# Altium project tcc_semsf.PrjPcb (part 3 of 3)

## Sheet seccionamento.SchDoc: Seccionamento
size A4; Author: Matheus Gois Vieira; Organization: UnB; Address1: Faculdade do Gama
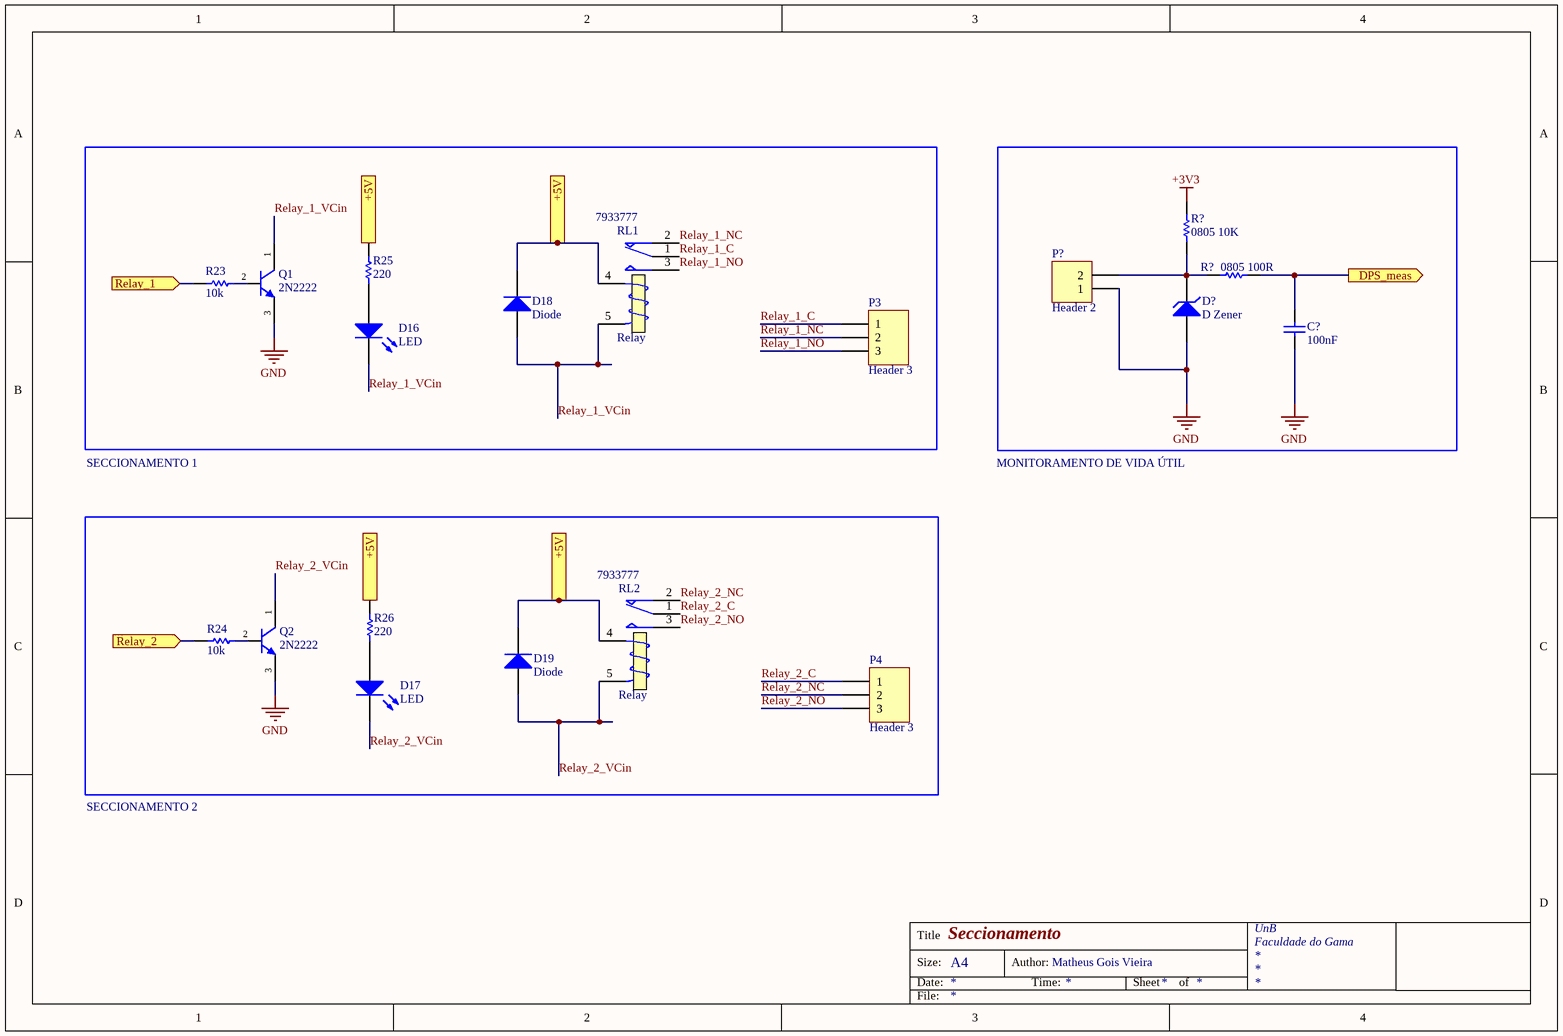
[diagram p2: seccionamento.SchDoc]

### Parts
(Parts that share a designator on the sheet are numbered #1, #2 ... from top to bottom, then left to right.)
C?#4  100nF  [0603]
D16  LED  [LED-0603-G]
D17  LED  [LED-0603-G]
D18  Diode  [SMC]
D19  Diode  [SMC]
D?#4  D Zener  [DIODE-SIGNAL]
P3  Header 3  [HDR1X3]
P4  Header 3  [HDR1X3]
P?  Header 2  [HDR1X2]
Q1  2N2222  [TO-220]
Q2  2N2222  [TO-220]
R23  10k  [R1608[0603]]
R24  10k  [R1608[0603]]
R25  220  [R1608[0603]]
R26  220  [R1608[0603]]
R?#3  0805 10K  [RES0805]
R?#4  0805 100R  [RES0805]
RL1  Relay  Supplier Part Number 1: 7933777  [FINDER-36.11]
RL2  Relay  Supplier Part Number 1: 7933777  [FINDER-36.11]

### Ports
+5V (in), DPS_meas (out), Relay_1 (in), Relay_2 (in)

### Nets
+3V3: R?#3.2
GND: C?#4.2 D?#4.1(A) P?.1 Q1.3(E) Q2.3(E)  [project net VSSA]
Relay_1_C: P3.1 RL1.1(COM)
Relay_1_NC: P3.2 RL1.2(NC)
Relay_1_NO: P3.3 RL1.3(NO)
Relay_1_VCin: D16.2(K) D18.1(A) Q1.1(C) RL1.5(T2)
Relay_2_C: P4.1 RL2.1(COM)
Relay_2_NC: P4.2 RL2.2(NC)
Relay_2_NO: P4.3 RL2.3(NO)
Relay_2_VCin: D17.2(K) D19.1(A) Q2.1(C) RL2.5(T2)
NetC?#4_1: C?#4.1 R?#4.2 ; port DPS_meas
NetD16_1: D16.1(A) R25.1
NetD17_1: D17.1(A) R26.1
NetD18_2: D18.2(K) D19.2(K) R25.2 R26.2 RL1.4(T1) RL2.4(T1) ; port +5V
NetD?#4_2: D?#4.2(K) P?.2 R?#3.1 R?#4.1
NetQ1_2: Q1.2(B) R23.2
NetQ2_2: Q2.2(B) R24.2
NetR23_1: R23.1 ; port Relay_1
NetR24_1: R24.1 ; port Relay_2

### Notes on the sheet
- SECCIONAMENTO 1
- MONITORAMENTO DE VIDA ÚTIL
- SECCIONAMENTO 2
- Title
- Size:
- Date:
- A4
- Author:
- Time:
- Sheet
- of
- File:

### Library data of the parts
C?#4 = CAP CER SMD-0603 100nF - 50V: Capacitor Ceramic 100nF 20% 50V 0603 (1608 Metric) X7R; MPN: C0603C104M5RACTU; Manufacturer: KEMET; CDI: 018177; Op_Temperature: -55 C to +125 C; Type: Capacitor Ceramic; Value: 100nF; Tolerance: 20%; Package: Tape & Reel; RoHS: SIM; Voltage: 50V; Case: 0603 (1608 Metric); Temp_Coefficient: X7R; NCM: *; CDI_Alternate: *; MPN_Alternate: *; Manufacturer_Alternate: *; Price (und.): 0,10000; Price (10k): 0.00741; Supplier 1: RSComponents; Supplier Part Number 1: 6698842
D16 D17 = LED: 0603(H=0.9mm) 绿色 λD=569nm VR=5V VF=2.1V~2.6V IF=20mA PD=100mW; Manufacturer Part Number: LTST-C190GKT; Color: Green; Lens Color: Colorless; Luminous Intensity: 6mcd; Forward Voltage: 2.1V; Viewing Angle: 130°; Lens Style: Clear,Diffused,Colorless,Rectangular; Forward Current: 30mA; Dominant Wavelength: 569nm; Test Current: 10mA; Wavelength: 565nm; Number of LEDs: 1; Power Dissipation: 100mW; Reverse Voltage: 5V; Lens Transparency: Clear; Voltage: 2V; Manufacturer: *; PartNumber: *; Package Type: *; Supplier 1: RSComponents; Supplier Part Number 1: 6920975P; RoHS: Yes; Category: LEDs; Stock 1: 30970; Pricing 1: 250=0,05500, 500=0,05200, 1250=0,03300, 2500=0,03100 (GBP); Mount: Surface Mount; Case/Package: 0603; Number of Pins: 2; Case Code (Metric): 1608; Case Code (Imperial): 0603; Min Operating Temperature: -55°C; Max Operating Temperature: 85°C; Packaging: Tape and Reel; Package Quantity: 1; Illumination Color: Green; Number of Elements: 1; Power Rating: 100mW; Length: 1.6mm; Width: 0.8mm; Height: 0.8mm; Depth: 0.8mm; Radiation Hardening: No; RoHS Compliant: Yes; Lead Free: Lead Free; ComponentLink1URL: https://datasheet.ciiva.com/2109/ltst-c190gkt-2109985.pdf?src-supplier=Digi-Key; ComponentLink1Description: https://datasheet.ciiva.com/2109/ltst-c190gkt-2109985.pdf?src-supplier=Digi-Key; ComponentLink2URL: https://datasheet.ciiva.com/11775/0900766b80dc02a6-11775616.pdf?src-supplier=RSComponents; ComponentLink2Description: https://datasheet.ciiva.com/11775/0900766b80dc02a6-11775616.pdf?src-supplier=RSComponents; ComponentLink3URL: https://datasheet.ciiva.com/12403/lite-on-ltst-c190gkt-187204-12403884.pdf?src-supplier=Mouser; ComponentLink3Description: https://datasheet.ciiva.com/12403/lite-on-ltst-c190gkt-187204-12403884.pdf?src-supplier=Mouser; ComponentLink4URL: https://datasheet.ciiva.com/16392/lite-on20ltst-c190gkt-16392818.pdf?src-supplier=Future+Electronics; ComponentLink4Description: https://datasheet.ciiva.com/16392/lite-on20ltst-c190gkt-16392818.pdf?src-supplier=Future+Electronics; ComponentLink5URL: https://datasheet.ciiva.com/2109/ltst-c190gkt-2109986.pdf?src-supplier=Digi-Key; ComponentLink5Description: https://datasheet.ciiva.com/2109/ltst-c190gkt-2109986.pdf?src-supplier=Digi-Key; ComponentLink6URL: https://datasheet.ciiva.com/2109/ltst-c190gkt-2109987.pdf?src-supplier=Digi-Key; ComponentLink6Description: https://datasheet.ciiva.com/2109/ltst-c190gkt-2109987.pdf?src-supplier=Digi-Key
D18 D19 = Diode: VR=100V IF=200mA; Manufacturer: ON Semiconductor / Fairchild; Manufacturer Part Number: FDLL4148; Polarity: Standard; Max Reverse Current: 5uA; Max Repetitive Reverse Voltage (Vrrm): 100V; Element Configuration: Single; Current Rating: 200mA; Forward Voltage: 1V; Max Forward Surge Current (Ifsm): 4A; Capacitance: 4pF; Power Dissipation: 500mW; Recovery Time: 4ns; Published: 8-Jun-2000; LatestRevisionDate: 17-Jul-2002; LatestRevisionNote: Re-released for DXP Platform.; PackageVersion: Sep-1996; PackageReference: SMC; Publisher: Altium Limited; PackageDescription: DO-214-AB/SMC; 2 C-Bend Leads; Body 7.9 x 5.9 mm, inc. leads (LxW); Code_JEDEC: DO-214-AB; Supplier 1: RSComponents; Supplier Part Number 1: 6708823; RoHS: Yes; Category: Rectifier Diodes; Stock 1: 2100; Pricing 1: 25=0,09200, 500=0,08700, 625=0,08300, 1250=0,07800, 2500=0,07500 (GBP); Mount: Surface Mount; Number of Pins: 34; Weight: 0.05184g; Contact Plating: Tin,Matte; Min Operating Temperature: -65°C; Max Operating Temperature: 175°C; Packaging: Tape and Reel; Package Quantity: 1; Voltage Rating (DC): 100V; Peak Non-Repetitive Surge Current: 4A; Output Current: 200mA; Max Surge Current: 4A; Average Rectified Current: 200mA; Max Reverse Voltage (DC): 100V; Forward Current: 200mA; Reverse Voltage: 100V; Reverse Recovery Time: 4ns; Length: 3.6mm; Width: 1.5mm; Height: 1.5mm; Radiation Hardening: No; RoHS Compliant: Yes; Lead Free: Lead Free; REACH SVHC: No SVHC; ComponentLink1URL: https://datasheet.ciiva.com/34301/785354-34301524.pdf?src-supplier=Jameco; ComponentLink1Description: https://datasheet.ciiva.com/34301/785354-34301524.pdf?src-supplier=Jameco; ComponentLink2URL: https://datasheet.ciiva.com/8053/30071-8053638.pdf?src-supplier=Element14; ComponentLink2Description: https://datasheet.ciiva.com/8053/30071-8053638.pdf?src-supplier=Element14; ComponentLink3URL: https://datasheet.ciiva.com/22714/1716967-22714318.pdf?src-supplier=Element14; ComponentLink3Description: https://datasheet.ciiva.com/22714/1716967-22714318.pdf?src-supplier=Element14; ComponentLink4URL: https://datasheet.ciiva.com/1181/1716967-1181018.pdf?src-supplier=Element14; ComponentLink4Description: https://datasheet.ciiva.com/1181/1716967-1181018.pdf?src-supplier=Element14; ComponentLink5URL: https://datasheet.ciiva.com/1180/1716967-1180972.pdf?src-supplier=Element14; ComponentLink5Description: https://datasheet.ciiva.com/1180/1716967-1180972.pdf?src-supplier=Element14; ComponentLink6URL: https://datasheet.ciiva.com/910/fdll4148-910350.pdf?src-supplier=Digi-Key; ComponentLink6Description: https://datasheet.ciiva.com/910/fdll4148-910350.pdf?src-supplier=Digi-Key; ComponentLink7URL: https://datasheet.ciiva.com/910/fdll4148-910351.pdf?src-supplier=Digi-Key; ComponentLink7Description: https://datasheet.ciiva.com/910/fdll4148-910351.pdf?src-supplier=Digi-Key; ComponentLink8URL: https://datasheet.ciiva.com/910/fdll4148-910349.pdf?src-supplier=Digi-Key; ComponentLink8Description: https://datasheet.ciiva.com/910/fdll4148-910349.pdf?src-supplier=Digi-Key
D?#4 = D Zener: Diode Zener Single 9.1V 5% 500mW 2-Pin(1+Tab) Power Mite T/R; Manufacturer Part Number: 1PMT5924BT1G; Test Current: 41.2mA; Max Power Dissipation: 3.2W; Impedance: 4R; Max Reverse Leakage Current: 5uA; Voltage Rating (DC): 6.2V; ESD Protection: Yes; Manufacturer: *; PartNumber: *; Package Type: *; Supplier 1: Newark; Supplier Part Number 1: 70K6994; RoHS: Yes; Category: Zener Diodes; Pricing 1: 1=0,25500, 3000=0,25500, 9000=0,23200, 24000=0,21400, 45000=0,20000 (USD); Case/Package: DO-216AA; Number of Pins: 2; Contact Plating: Tin,Matte; Min Operating Temperature: -55°C; Max Operating Temperature: 150°C; Packaging: Tape and Reel; Zener Voltage: 9.1V; Voltage Tolerance: 5%; Power Dissipation: 500mW; Element Configuration: Single; Package Quantity: 1; Tolerance: 5%; Power Rating: 3.2W; Breakdown Voltage: 6.2V; Length: 2.18mm; Width: 2.05mm; Height: 1.15mm; Radiation Hardening: No; Lead Free: Lead Free; RoHS Compliant: Yes; Halogen Free: Halogen Free; ComponentLink1URL: https://datasheet.ciiva.com/4735/1pmt5920b-d-40129-4735077.pdf?src-supplier=Mouser; ComponentLink1Description: https://datasheet.ciiva.com/4735/1pmt5920b-d-40129-4735077.pdf?src-supplier=Mouser; ComponentLink2URL: https://datasheet.ciiva.com/26092/1pmt5920b-d-26092383.pdf?src-supplier=Avnet+Europe; ComponentLink2Description: https://datasheet.ciiva.com/26092/1pmt5920b-d-26092383.pdf?src-supplier=Avnet+Europe; ComponentLink3URL: https://datasheet.ciiva.com/10638/1pmt5920b-d-10638985.pdf?src-supplier=Avnet; ComponentLink3Description: https://datasheet.ciiva.com/10638/1pmt5920b-d-10638985.pdf?src-supplier=Avnet
P3 P4 = Header 3: Conn Terminal Block 3 POS 5mm Solder ST Thru-Hole 15A Bulk; Manufacturer: Lumberg; Manufacturer Part Number: KRESS03; Max Supply Voltage (AC): 250V; Number of Poles: 3; Approvals: UL,CSA,VDE; LatestRevisionDate: 17-Jul-2002; LatestRevisionNote: Re-released for DXP Platform.; Publisher: Altium Limited; Supplier 1: RSComponents; Supplier Part Number 1: 2508732301; RoHS: Yes; Category: Connectors; Housing Material: Polyamide; Min Operating Temperature: -25°C; Max Operating Temperature: 100°C; Packaging: Bulk; Number of Rows: 1; Max Current Rating: 15A; Termination: Solder; Orientation: Straight; Current Rating: 15A; Voltage Rating: 250V; Length: 15mm; Depth: 8.3mm; RoHS Compliant: Yes; ComponentLink1URL: https://www.alliedelec.com/m/d/febd0e8d7554432b76be7d34941e766f.pdf?src-supplier=Allied+Electronics; ComponentLink1Description: https://www.alliedelec.com/m/d/febd0e8d7554432b76be7d34941e766f.pdf?src-supplier=Allied+Electronics; ComponentLink2URL: http://components.arrow.com/part/dataview/0323_01039480?src-supplier=Arrow+Europe; ComponentLink2Description: http://components.arrow.com/part/dataview/0323_01039480?src-supplier=Arrow+Europe
P? = Header 2: 间距5.08mm 2pin 母座 12A 320V 弯插 封边; Manufacturer: Phoenix Contact; Manufacturer Part Number: 1757242; Number of Positions: 2; Voltage Rating: 250V; Connector Type: Plug; Gender: Male; Number of Levels: 1; Current: 15A; Voltage: 300V; Pitch: 5.08mm; Approvals: UL,CSA,VDE,EN; LatestRevisionDate: 17-Jul-2002; LatestRevisionNote: Re-released for DXP Platform.; Publisher: Altium Limited; Supplier 1: RSComponents; Supplier Part Number 1: 1896105; RoHS: Yes; Category: Terminal Blocks; Stock 1: 1395; Pricing 1: 5=0,48800, 75=0,44200, 250=0,40400, 500=0,36600, 1000=0,34200 (GBP); Mount: Through Hole; Contact Plating: Tin; Color: Grey,Green; Housing Material: PBT; Contact Material: Tin; Housing Color: Green; Weight: 5.396916oz; Number of Rows: 1; Package Quantity: 50; Packaging: Bulk; Termination: Solder; Number of Contacts: 2; Orientation: Right Angle; Series: MSTBA; Current Rating: 12A; Voltage Rating (DC): 320V; Max Current Rating: 12A; Number of Poles: 2; Number of Positions Per Level: 2; Length: 12.16mm; Width: 12.1mm; Height: 12.08mm; Depth: 12mm; Flammability Rating: UL94 V-0; RoHS Compliant: Yes; REACH SVHC: No SVHC; Lead Free: Lead Free; ComponentLink1URL: https://datasheet.ciiva.com/16096/1757242-16096402.pdf?src-supplier=Onlinecomponents.com; ComponentLink1Description: https://datasheet.ciiva.com/16096/1757242-16096402.pdf?src-supplier=Onlinecomponents.com; ComponentLink2URL: https://datasheet.ciiva.com/15197/getdatasheetpartid-176350-15197328.pdf?src-supplier=Verical; ComponentLink2Description: https://datasheet.ciiva.com/15197/getdatasheetpartid-176350-15197328.pdf?src-supplier=Verical; ComponentLink3URL: https://datasheet.ciiva.com/795/1757242-795407.pdf?src-supplier=Digi-Key; ComponentLink3Description: https://datasheet.ciiva.com/795/1757242-795407.pdf?src-supplier=Digi-Key; ComponentLink4URL: https://datasheet.ciiva.com/29210/569017-da-01-en-grundgehaeuse-1757242-250-st-29210285.pdf?src-supplier=Conrad; ComponentLink4Description: https://datasheet.ciiva.com/29210/569017-da-01-en-grundgehaeuse-1757242-250-st-29210285.pdf?src-supplier=Conrad; ComponentLink5URL: https://datasheet.ciiva.com/7630/100955-7630839.pdf?src-supplier=Element14; ComponentLink5Description: https://datasheet.ciiva.com/7630/100955-7630839.pdf?src-supplier=Element14; ComponentLink6URL: https://datasheet.ciiva.com/33105/1757242-33105868.pdf?src-supplier=Today+Components; ComponentLink6Description: https://datasheet.ciiva.com/33105/1757242-33105868.pdf?src-supplier=Today+Components
Q1 Q2 = NPN: NPN Bipolar Transistor; Manufacturer: *; PartNumber: *; Package Type: *
R23 R24 = R: Res, 10K, 0.01%, 0.25W, 1206, Metal Foil; Manufacturer Part Number: Y163010K0000T9R; Value: 0; Resistance: 10kR; Max Power Dissipation: 250mW; Temperature Coefficient: 0.2ppm/°C; Manufacturer: *; PartNumber: *; Package Type: *; Supplier 1: Digi-Key; Supplier Part Number 1: Y1630-10.0KBCT-ND; RoHS: Yes; Category: Chip SMD Resistors; Stock 1: 1437; Pricing 1: 1=11,40000, 10=10,36300, 25=9,32640, 50=8,03100, 100=7,38340 (USD); Case/Package: 1206; Case Code (Metric): 3216; Case Code (Imperial): 1206; Min Operating Temperature: -55°C; Max Operating Temperature: 150°C; Package Quantity: 1; Packaging: Tape and Reel; Tolerance: 0.01%; Resistor Type: Metal Foil; Number of Terminations: 2; Features: Moisture Resistant,Anti-Sulfur; Length: 0.126inch; Width: 0.062inch; Height: 0.025inch; RoHS Compliant: Yes; ComponentLink1URL: https://datasheet.ciiva.com/29711/vfcpseri-29711161.pdf?src-supplier=Digi-Key; ComponentLink1Description: https://datasheet.ciiva.com/29711/vfcpseri-29711161.pdf?src-supplier=Digi-Key; ComponentLink2URL: https://datasheet.ciiva.com/29711/vfcpseri-29711162.pdf?src-supplier=Digi-Key; ComponentLink2Description: https://datasheet.ciiva.com/29711/vfcpseri-29711162.pdf?src-supplier=Digi-Key; ComponentLink3URL: https://datasheet.ciiva.com/18610/vfcpseri-18610015.pdf?src-supplier=Digi-Key; ComponentLink3Description: https://datasheet.ciiva.com/18610/vfcpseri-18610015.pdf?src-supplier=Digi-Key
R25 R26 = R: Res Thick Film 0603 220 Ohm 1% 1/10W ±100ppm/°C Molded SMD Paper T/R; Manufacturer Part Number: Y163010K0000T9R; Value: 0; Resistance: 10kR; Tolerance: 0.01%; Max Power Dissipation: 250mW; Temperature Coefficient: 0.2ppm/°C; Power Rating: 100mW; Voltage Rating: 50V; Manufacturer: *; PartNumber: *; Package Type: *; RoHS: Yes; Category: Chip SMD Resistors; Stock 1: 11812; Pricing 1: 10=0,01500, 25=0,01200, 50=0,00900, 100=0,00600 (USD); Case/Package: 1206; Case Code (Metric): 3216; Case Code (Imperial): 1206; Min Operating Temperature: -55°C; Max Operating Temperature: 150°C; Package Quantity: 1; Packaging: Tape and Reel; Resistor Type: Metal Foil; Number of Terminations: 2; Features: Moisture Resistant,Anti-Sulfur; Length: 0.126inch; Width: 0.062inch; Height: 0.025inch; RoHS Compliant: Yes; ComponentLink1URL: https://datasheet.ciiva.com/29711/vfcpseri-29711161.pdf?src-supplier=Digi-Key; ComponentLink1Description: https://datasheet.ciiva.com/29711/vfcpseri-29711161.pdf?src-supplier=Digi-Key; ComponentLink2URL: https://datasheet.ciiva.com/29711/vfcpseri-29711162.pdf?src-supplier=Digi-Key; ComponentLink2Description: https://datasheet.ciiva.com/29711/vfcpseri-29711162.pdf?src-supplier=Digi-Key; ComponentLink3URL: https://datasheet.ciiva.com/18610/vfcpseri-18610015.pdf?src-supplier=Digi-Key; ComponentLink3Description: https://datasheet.ciiva.com/18610/vfcpseri-18610015.pdf?src-supplier=Digi-Key; Supplier 1: Newark; Supplier Part Number 1: 82AH6497; Termination: SMD/SMT; Series: AC; ComponentLink4URL: http://www.yageo.com/NewPortal/yageodocoutput?fileName=/pdf/R-Chip/PYu-AC_51_RoHS_L_6.pdf&src-supplier=Mouser; ComponentLink4Description: http://www.yageo.com/NewPortal/yageodocoutput?fileName=/pdf/R-Chip/PYu-AC_51_RoHS_L_6.pdf&src-supplier=Mouser; ComponentLink5URL: http://www.yageo.com/NewPortal/yageodocoutput?fileName=/pdf/R-Chip/PYu-AC_51_RoHS_L_6.pdf&src-supplier=Arrow+Electronics; ComponentLink5Description: http://www.yageo.com/NewPortal/yageodocoutput?fileName=/pdf/R-Chip/PYu-AC_51_RoHS_L_6.pdf&src-supplier=Arrow+Electronics; ComponentLink6URL: http://www.yageo.com/NewPortal/yageodocoutput?fileName=/pdf/R-Chip/PYu-AC_51_RoHS_L_6.pdf&src-supplier=Avnet+Europe; ComponentLink6Description: http://www.yageo.com/NewPortal/yageodocoutput?fileName=/pdf/R-Chip/PYu-AC_51_RoHS_L_6.pdf&src-supplier=Avnet+Europe; ComponentLink7URL: http://www.yageo.com/NewPortal/yageodocoutput?fileName=/pdf/R-Chip/PYu-AC_51_RoHS_L_6.pdf&src-supplier=Digi-Key; ComponentLink7Description: http://www.yageo.com/NewPortal/yageodocoutput?fileName=/pdf/R-Chip/PYu-AC_51_RoHS_L_6.pdf&src-supplier=Digi-Key; ComponentLink8URL: http://www.yageo.com/NewPortal/yageodocoutput?fileName=/pdf/R-Chip/PYu-AC_51_RoHS_L_6.pdf&src-supplier=TTI; ComponentLink8Description: http://www.yageo.com/NewPortal/yageodocoutput?fileName=/pdf/R-Chip/PYu-AC_51_RoHS_L_6.pdf&src-supplier=TTI; ComponentLink9URL: http://www.yageo.com/NewPortal/yageodocoutput?fileName=/pdf/R-Chip/PYu-AC_51_RoHS_L_6.pdf&src-supplier=Schukat; ComponentLink9Description: http://www.yageo.com/NewPortal/yageodocoutput?fileName=/pdf/R-Chip/PYu-AC_51_RoHS_L_6.pdf&src-supplier=Schukat; ComponentLink10URL: http://www.yageo.com/NewPortal/yageodocoutput?fileName=/pdf/R-Chip/PYu-AC_51_RoHS_L_6.pdf&src-supplier=NAC+Semi; ComponentLink10Description: http://www.yageo.com/NewPortal/yageodocoutput?fileName=/pdf/R-Chip/PYu-AC_51_RoHS_L_6.pdf&src-supplier=NAC+Semi; ComponentLink11URL: http://www.yageo.com/NewPortal/yageodocoutput?fileName=/pdf/R-Chip/PYu-AC_51_RoHS_L_6.pdf&src-supplier=Rutronik; ComponentLink11Description: http://www.yageo.com/NewPortal/yageodocoutput?fileName=/pdf/R-Chip/PYu-AC_51_RoHS_L_6.pdf&src-supplier=Rutronik
R?#3 = RC0805FR-0710KL: 10K Omhs 0805 ± 1.00% 0.125W ± 100ppm/℃; Manufacturer: Yageo; Manufacturer Part Number: RC0603FR-0710KL; Tolerance: 1%; Resistance: 10kR; Temperature Coefficient: 100ppm/°C; Voltage Rating: 75V; Voltage Rating (DC): 50V; Power Rating: 100mW; RoHS: Yes; Category: Chip SMD Resistors; Stock 1: 19091268; Pricing 1: 5000=0,00312 (USD); Case/Package: 0603; Number of Pins: 2; Case Code (Imperial): 0603; Case Code (Metric): 1608; Weight: 7.1E-05oz; Size Code: 0603; Min Operating Temperature: -55°C; Max Operating Temperature: 155°C; Resistor Type: Thick Film; Packaging: Tape and Reel; Termination: SMD/SMT; Features: Moisture Resistant; Series: RC; Max Power Dissipation: 100mW; Number of Terminations: 2; Resistance Tolerance: 1%; Construction: Rectangular; Length: 1.6mm; Width: 0.8mm; Height: 0.45mm; Depth: 0.8mm; Lead Pitch: 0.3mm; RoHS Compliant: Yes; REACH SVHC: Unknown; Military Standard: Not; Lead Free: Lead Free; ComponentLink1URL: https://datasheet.ciiva.com/7660/38590-7660789.pdf?src-supplier=Element14; ComponentLink1Description: https://datasheet.ciiva.com/7660/38590-7660789.pdf?src-supplier=Element14; ComponentLink2URL: https://datasheet.ciiva.com/7983/443971-7983596.pdf?src-supplier=Element14; ComponentLink2Description: https://datasheet.ciiva.com/7983/443971-7983596.pdf?src-supplier=Element14; ComponentLink3URL: https://datasheet.ciiva.com/22747/443971-22747519.pdf?src-supplier=Element14; ComponentLink3Description: https://datasheet.ciiva.com/22747/443971-22747519.pdf?src-supplier=Element14; ComponentLink4URL: https://datasheet.ciiva.com/46440/1868787-46440891.pdf?src-supplier=Element14; ComponentLink4Description: https://datasheet.ciiva.com/46440/1868787-46440891.pdf?src-supplier=Element14; ComponentLink5URL: https://datasheet.ciiva.com/7746/1738695-7746239.pdf?src-supplier=Element14; ComponentLink5Description: https://datasheet.ciiva.com/7746/1738695-7746239.pdf?src-supplier=Element14; ComponentLink6URL: https://datasheet.ciiva.com/15189/getdatasheetpartid-409289-15189591.pdf?src-supplier=Verical; ComponentLink6Description: https://datasheet.ciiva.com/15189/getdatasheetpartid-409289-15189591.pdf?src-supplier=Verical; Stock 2: 435000; Pricing 2: 5000=0,00700 (USD); Package Quantity: 1; Technology: THICK FILM; ComponentLink7URL: https://datasheet.ciiva.com/11808/0900766b8106beab-11808151.pdf?src-supplier=RSComponents; ComponentLink7Description: https://datasheet.ciiva.com/11808/0900766b8106beab-11808151.pdf?src-supplier=RSComponents; ComponentLink8URL: https://datasheet.ciiva.com/46447/444164-46447563.pdf?src-supplier=Element14; ComponentLink8Description: https://datasheet.ciiva.com/46447/444164-46447563.pdf?src-supplier=Element14; ComponentLink9URL: https://datasheet.ciiva.com/2456/pyu-r-int-thick-7-2456973.pdf?src-supplier=Digi-Key; ComponentLink9Description: https://datasheet.ciiva.com/2456/pyu-r-int-thick-7-2456973.pdf?src-supplier=Digi-Key; ComponentLink10URL: https://datasheet.ciiva.com/2456/pyu-r-int-thick-7-2456974.pdf?src-supplier=Digi-Key; ComponentLink10Description: https://datasheet.ciiva.com/2456/pyu-r-int-thick-7-2456974.pdf?src-supplier=Digi-Key; ComponentLink11URL: https://datasheet.ciiva.com/2456/pyu-r-int-thick-7-2456972.pdf?src-supplier=Digi-Key; ComponentLink11Description: https://datasheet.ciiva.com/2456/pyu-r-int-thick-7-2456972.pdf?src-supplier=Digi-Key; ComponentLink12URL: https://datasheet.ciiva.com/12669/rc0805-12669688.pdf?src-supplier=Mouser; ComponentLink12Description: https://datasheet.ciiva.com/12669/rc0805-12669688.pdf?src-supplier=Mouser; ComponentLink13URL: https://datasheet.ciiva.com/16747/rc0805-16747087.pdf?src-supplier=Future+Electronics; ComponentLink13Description: https://datasheet.ciiva.com/16747/rc0805-16747087.pdf?src-supplier=Future+Electronics; Supplier 1: RSComponents; Supplier Part Number 1: 6185163
R?#4 = RC0805FR-07100RL: 100R ± 1.00% 0.125W ± 100ppm/℃ 0805; Manufacturer: Yageo; Tolerance: 1%; Voltage Rating (DC): 150V; Temperature Coefficient: 100ppm/°C; Power Rating: 125mW; Application(s): HIGH RELIABILITY; Supplier 1: RSComponents; Manufacturer Part Number: RC0805FR-07100RL; RoHS: Yes; Category: Chip SMD Resistors; Stock 1: 45000; Pricing 1: 5000=0,00700 (USD); Case/Package: 0805; Number of Pins: 2; Case Code (Imperial): 0805; Case Code (Metric): 2012; Weight: 0.000917oz; Min Operating Temperature: -55°C; Max Operating Temperature: 155°C; Resistance: 100R; Packaging: Cut Tape; Resistor Type: Thick Film; Voltage Rating: 150V; Package Quantity: 5000; Termination: SMD/SMT; Number of Terminations: 2; Max Power Dissipation: 125mW; Features: Moisture Resistant; Type: General Purpose; Series: RC; Technology: THICK FILM; Length: 2mm; Width: 1.25mm; Height: 0.5mm; Depth: 1.25mm; Lead Pitch: 0.4mm; REACH SVHC: Unknown; Lead Free: Lead Free; Military Standard: Not; RoHS Compliant: Yes; ComponentLink1URL: https://datasheet.ciiva.com/11808/0900766b8106beab-11808877.pdf?src-supplier=RSComponents; ComponentLink1Description: https://datasheet.ciiva.com/11808/0900766b8106beab-11808877.pdf?src-supplier=RSComponents; ComponentLink2URL: https://datasheet.ciiva.com/7941/1697719-7941680.pdf?src-supplier=Element14; ComponentLink2Description: https://datasheet.ciiva.com/7941/1697719-7941680.pdf?src-supplier=Element14; ComponentLink3URL: https://datasheet.ciiva.com/7941/1686128-7941679.pdf?src-supplier=Element14; ComponentLink3Description: https://datasheet.ciiva.com/7941/1686128-7941679.pdf?src-supplier=Element14; ComponentLink4URL: https://datasheet.ciiva.com/7660/38627-7660797.pdf?src-supplier=Element14; ComponentLink4Description: https://datasheet.ciiva.com/7660/38627-7660797.pdf?src-supplier=Element14; ComponentLink5URL: https://datasheet.ciiva.com/22747/444164-22747535.pdf?src-supplier=Element14; ComponentLink5Description: https://datasheet.ciiva.com/22747/444164-22747535.pdf?src-supplier=Element14; ComponentLink6URL: https://datasheet.ciiva.com/46447/444164-46447562.pdf?src-supplier=Element14; ComponentLink6Description: https://datasheet.ciiva.com/46447/444164-46447562.pdf?src-supplier=Element14; ComponentLink7URL: https://datasheet.ciiva.com/2456/pyu-r-int-thick-7-2456988.pdf?src-supplier=Digi-Key; ComponentLink7Description: https://datasheet.ciiva.com/2456/pyu-r-int-thick-7-2456988.pdf?src-supplier=Digi-Key; ComponentLink8URL: https://datasheet.ciiva.com/2456/pyu-r-int-thick-7-2456989.pdf?src-supplier=Digi-Key; ComponentLink8Description: https://datasheet.ciiva.com/2456/pyu-r-int-thick-7-2456989.pdf?src-supplier=Digi-Key; ComponentLink9URL: https://datasheet.ciiva.com/2456/pyu-r-int-thick-7-2456987.pdf?src-supplier=Digi-Key; ComponentLink9Description: https://datasheet.ciiva.com/2456/pyu-r-int-thick-7-2456987.pdf?src-supplier=Digi-Key; ComponentLink10URL: https://datasheet.ciiva.com/17082/rc0805-17082697.pdf?src-supplier=Future+Electronics; ComponentLink10Description: https://datasheet.ciiva.com/17082/rc0805-17082697.pdf?src-supplier=Future+Electronics; Supplier Part Number 1: 6185135
RL1 RL2 = Relay: SPDT PCB Mount Non-Latching Relay Through Hole; 12V dc; Manufacturer Part Number: 36.11.9.012.4011; Contact Current Rating: 10A; Coil Resistance: 400R; Coil Power: 360mW; Switching Capacity: 500W; Test Voltage: 2.5kV; Coil Current: 30mA; Ratings: IP67; Manufacturer: *; Package Type: *; PartNumber: *; Supplier 1: RSComponents; RoHS: Yes; Category: Power Relays; Stock 1: 639; Pricing 1: 1=1,68000, 10=1,56000, 25=1,47000, 50=1,43000, 100=1,32000 (GBP); Mount: PCB; Contact Material: Tin,Silver; Min Operating Temperature: -40°C; Max Operating Temperature: 85°C; Termination: Through Hole; Switching Current: 10A; Throw Configuration: SPDT; Coil Voltage (DC): 12V; Length: 19mm; Width: 15.5mm; Height: 16mm; Depth: 15.5mm; REACH SVHC: No SVHC; RoHS Compliant: Yes; ComponentLink1URL: https://datasheet.ciiva.com/30469/0900766b812a2bcc-30469325.pdf?src-supplier=RSComponents; ComponentLink1Description: https://datasheet.ciiva.com/30469/0900766b812a2bcc-30469325.pdf?src-supplier=RSComponents; ComponentLink2URL: https://datasheet.ciiva.com/22666/1699475-22666502.pdf?src-supplier=Element14; ComponentLink2Description: https://datasheet.ciiva.com/22666/1699475-22666502.pdf?src-supplier=Element14

## Sheet controlador.SchDoc
size A4
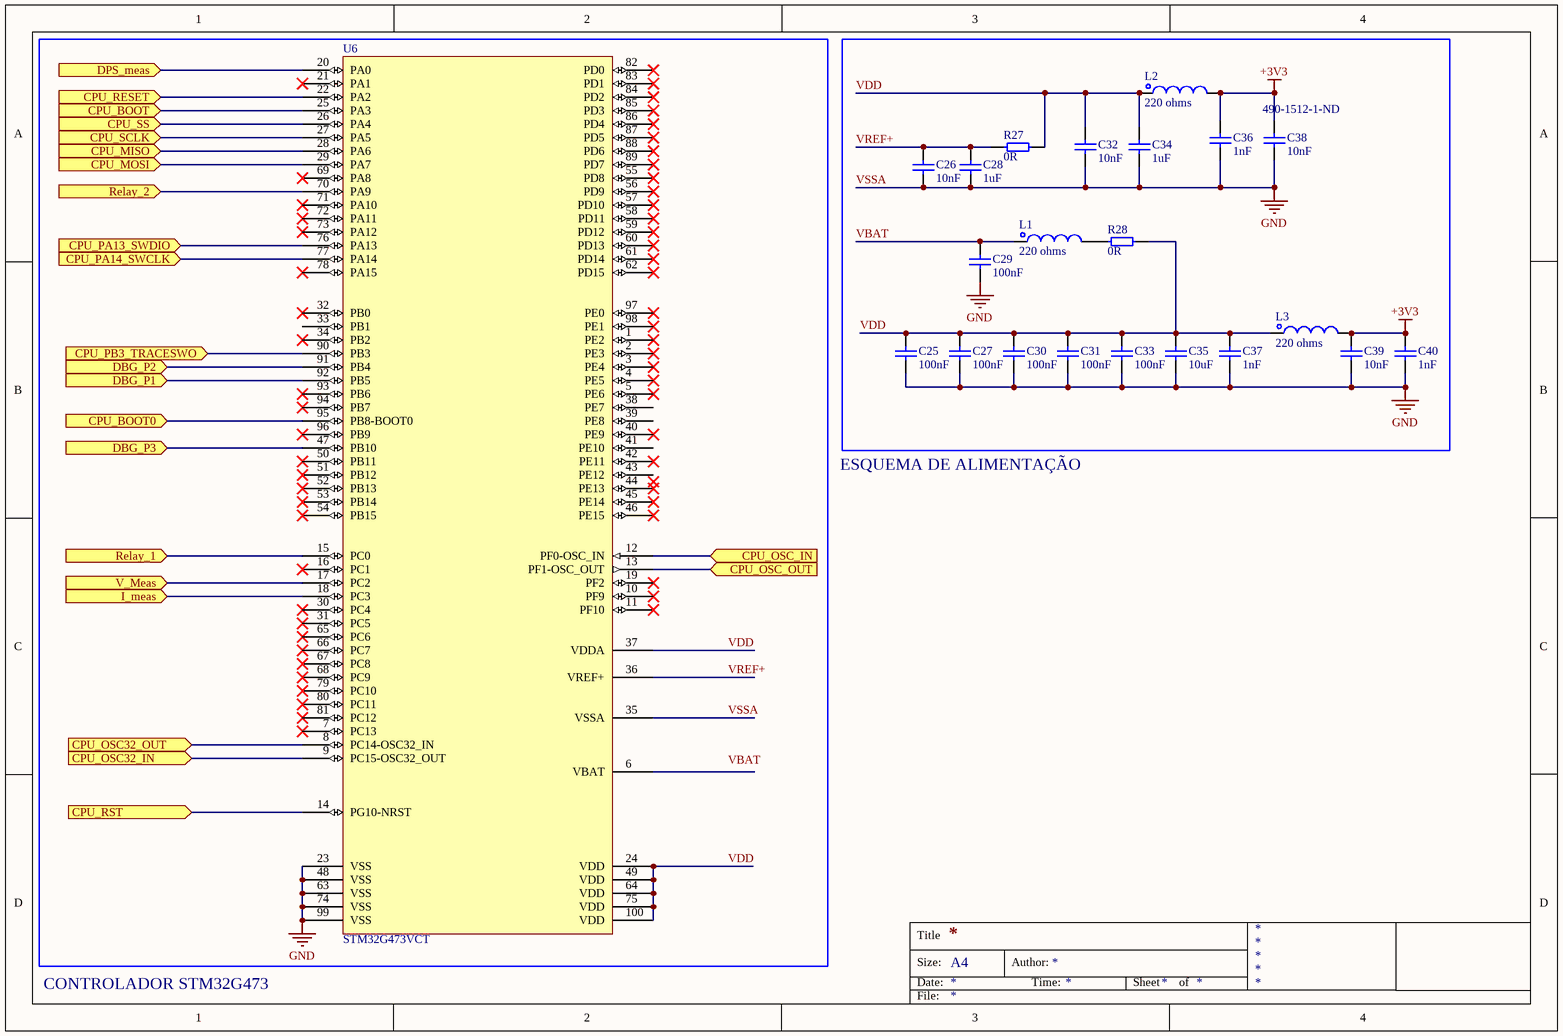
[diagram p3: controlador.SchDoc]

### Parts
C25  100nF  [0603]
C26  10nF  [0603]
C27  100nF  [0603]
C28  1uF  [0603]
C29  100nF  [0603]
C30  100nF  [0603]
C31  100nF  [0603]
C32  10nF  [0603]
C33  100nF  [0603]
C34  1uF  [0603]
C35  10uF  [0603]
C36  1nF  [0603]
C37  1nF  [0603]
C38  10nF  Supplier Part Number 1: 490-1512-1-ND  [0603]
C39  10nF  [0603]
C40  1nF  [0603]
L1  220 ohms  [0603]
L2  220 ohms  [0603]
L3  220 ohms  [0603]
R27  0R  [0603]
R28  0R  [0603]
U6  STM32G473VCT  [LQFP100_14MMX14MM]

### Ports
CPU_BOOT0 (in), CPU_BOOT (in), CPU_MISO (in), CPU_MOSI (in), CPU_OSC32_IN (in), CPU_OSC32_OUT (in), CPU_OSC_IN (in), CPU_OSC_OUT (in), CPU_PA13_SWDIO (in), CPU_PA14_SWCLK (in), CPU_PB3_TRACESWO (in), CPU_RESET (in), CPU_RST (in), CPU_SCLK (in), CPU_SS (in), DBG_P1 (in), DBG_P2 (in), DBG_P3 (in), DPS_meas (in), I_meas (in), Relay_1 (in), Relay_2 (in), V_Meas (in)

### Nets
+3V3: C36.2 C38.2 C39.2 C40.2 L2.2 L3.2
VSSA: C25.2 C26.1 C27.2 C28.1 C29.2 C30.2 C31.2 C32.1 C33.2 C34.1 C35.1 C36.1 C37.1 C38.1 C39.1 C40.1 U6.18(PC3) U6.23(VSS) U6.35(VSSA) U6.48(VSS) U6.63(VSS) U6.74(VSS) U6.99(VSS) ; port I_meas  [also labelled GND]
CPU_RST: U6.14(PG10-NRST) ; port CPU_RST
VBAT: C29.1 L1.1
VDD: C25.1 C27.1 C30.1 C31.1 C32.2 C33.1 C34.2 C35.2 C37.2 L2.1 L3.1 R27.1 R28.2 U6.24(VDD) U6.37(VDDA) U6.49(VDD) U6.64(VDD) U6.75(VDD) U6.100(VDD)
VREF+: C26.2 C28.2 R27.2 U6.36(VREF+)
NetC18_2: U6.17(PC2) ; port V_Meas
NetC46_2: U6.8(PC14-OSC32_IN) ; port CPU_OSC32_OUT
NetC47_2: U6.9(PC15-OSC32_OUT) ; port CPU_OSC32_IN
NetC48_2: U6.13(PF1-OSC_OUT) ; port CPU_OSC_OUT
NetC49_2: U6.12(PF0-OSC_IN) ; port CPU_OSC_IN
NetC?#4_1: U6.20(PA0) ; port DPS_meas
NetD20_2: U6.77(PA14) ; port CPU_PA14_SWCLK
NetD21_2: U6.76(PA13) ; port CPU_PA13_SWDIO
NetD24_2: U6.90(PB3) ; port CPU_PB3_TRACESWO
NetL1_2: L1.2 R28.1
NetQ6_3: U6.95(PB8-BOOT0) ; port CPU_BOOT0
NetR23_1: U6.15(PC0) ; port Relay_1
NetR24_1: U6.70(PA9) ; port Relay_2
NetR40_1: U6.91(PB4) ; port DBG_P2
NetR41_1: U6.47(PB10) ; port DBG_P3
NetR42_1: U6.92(PB5) ; port DBG_P1
NetU6_22: U6.22(PA2) ; port CPU_RESET
NetU6_25: U6.25(PA3) ; port CPU_BOOT
NetU6_26: U6.26(PA4) ; port CPU_SS
NetU6_27: U6.27(PA5) ; port CPU_SCLK
NetU6_28: U6.28(PA6) ; port CPU_MISO
NetU6_29: U6.29(PA7) ; port CPU_MOSI

Not connected (* = marked no-connect by the designer): U6 1(PE2)* 2(PE3)* 3(PE4)* 4(PE5)* 5(PE6)* 6(VBAT) 7(PC13)* 10(PF9)* 11(PF10)* 16(PC1)* 19(PF2)* 21(PA1)* 30(PC4)* 31(PC5)* 32(PB0)* 33(PB1) 34(PB2)* 38(PE7) 39(PE8) 40(PE9)* 41(PE10) 42(PE11)* 43(PE12) 44(PE13)* 45(PE14)* 46(PE15)* 50(PB11)* 51(PB12)* 52(PB13)* 53(PB14)* 54(PB15)* 55(PD8)* 56(PD9)* 57(PD10)* 58(PD11)* 59(PD12)* 60(PD13)* 61(PD14)* 62(PD15)* 65(PC6)* 66(PC7)* 67(PC8)* 68(PC9)* 69(PA8)* 71(PA10)* 72(PA11)* 73(PA12)* 78(PA15)* 79(PC10)* 80(PC11)* 81(PC12)* 82(PD0)* 83(PD1)* 84(PD2)* 85(PD3)* 86(PD4)* 87(PD5)* 88(PD6)* 89(PD7)* 93(PB6)* 94(PB7)* 96(PB9)* 97(PE0)* 98(PE1)*

### Notes on the sheet
- ESQUEMA DE ALIMENTAÇÃO
- CONTROLADOR STM32G473
- Labels drawn without touching a wire or pin: VBAT
- Title
- Size:
- Date:
- A4
- Author:
- Time:
- Sheet
- of
- File:

### Library data of the parts
C25 C27 C29-C31 C33 = CAP CER SMD-0603 100nF - 50V: as C?#4 on sheet seccionamento; Type: Capacitor Ceramic; Value: 100nF; Tolerance: 20%; Package: Tape & Reel; RoHS: SIM; Voltage: 50V; Case: 0603 (1608 Metric); Temp_Coefficient: X7R; NCM: *; CDI_Alternate: *; MPN_Alternate: *; Manufacturer_Alternate: *; Price (und.): 0,10000; Price (10k): 0.00741; Supplier 1: RSComponents; Supplier Part Number 1: 6698842
C26 C32 C38 C39 = CAP CER SMD-0603 10nF - 50V: Capacitor Ceramic 10nF 10% 50V 0603 (1608 Metric) X7R; MPN: 06035C103KAT4A; Manufacturer: AVX; CDI: 017932; Op_Temperature: -55 C to +125 C; Type: Capacitor Ceramic; Value: 10nF; Tolerance: 10%; Package: Tape & Reel; RoHS: SIM; Voltage: 50V; Case: 0603 (1608 Metric); Temp_Coefficient: X7R; NCM: *; CDI_Alternate: *; MPN_Alternate: *; Manufacturer_Alternate: *; Price (und.): 0,10000; Price (10k): 0.00621
  C26 C39: Supplier 1: Digi-Key; Supplier Part Number 1: 490-1512-1-ND
  C38: Supplier 1: Digi-Key
C28 C34 = CAP CER SMD-0603 1uF - 16V: Capacitor Ceramic 1uF 10% 16V 0603 (1608 Metric) X7R; MPN: 0603YC105KAT2A; Manufacturer: AVX; CDI: 018282; Op_Temperature: -55 C to +125 C; Type: Capacitor Ceramic; Value: 1uF; Tolerance: 10%; Package: Tape & Reel; RoHS: SIM; Voltage: 16V; Case: 0603 (1608 Metric); Temp_Coefficient: X7R; NCM: *; CDI_Alternate: *; MPN_Alternate: *; Manufacturer_Alternate: *; Price (und.): 0,21000; Price (10k): 0.03795; Supplier 1: Digi-Key; Supplier Part Number 1: 490-3897-1-ND
  C34: Supplier 2: Digi-Key; Supplier Part Number 2: 490-1512-1-ND
C35 = CAP CER SMD-0603 10uF - 10V: Capacitor Ceramic 10µF 10% 10V 0603 (1608 Metric) X7R; MPN: C3216X7R1C106K160AC; Manufacturer: TDK; MPN_Alternate: C0603C106M8PAC7411; CDI: 017467; Op_Temperature: -55 C to +125 C; Type: Capacitor Ceramic; Value: 10uF; Voltage: 10V; Tolerance: 10%; Package: Tape & Reel; Case: 0603 (1608 Metric); Temp_Coefficient: X7R; RoHS: SIM; NCM: *; CDI_Alternate: *; Manufacturer_Alternate: *; Price (und.): 0.33; Price (10k): 0.07; Supplier 1: Newark; Supplier Part Number 1: 03AC2652
C36 C37 C40 = CAP CER SMD-0603 1nF - 50V: Capacitor Ceramic 1nF 5% 50V 0603 (1608 Metric) C0G (NP0); MPN: GRM1885C1H102JA01D; Manufacturer: Murata; MPN_Alternate: CGA3E2C0G1H102J080AE; CDI: 017469; Op_Temperature: -55 C to +125 C; Type: Capacitor Ceramic; Value: 1nF; Tolerance: 5%; Package: Tape & Reel; RoHS: SIM; Voltage: 50V; Case: 0603 (1608 Metric); Temp_Coefficient: C0G (NP0); NCM: *; CDI_Alternate: *; Manufacturer_Alternate: *; Price (und.): 0,10000; Price (10k): 0.01032; Supplier 1: RSComponents; Supplier Part Number 1: 1356303
L1-L3 = INDUTOR BEAD - 2.2A - 50 OHMS 100 MHZ: INDUTOR BEAD - 2.2A - 220 OHMS 100 MHZ; MPN: BLM18KG221SZ1D; Manufacturer: Murata; Type: Ferrite Bead; Tolerance: 25%; Frequency: 100 MHz; Op_Temperature: -55°C ~ 125°C; CDI: 014249; Value: 220 ohms; Package: Tape & Reel; RoHS: SIM; Case: 0603; Current: 2.2 A; Price (10k): 0.02146; Price (und.): 0,10000; Supplier 1: Newark; Supplier Part Number 1: 73M9123
R27 R28 = RES SMD-0603 0R 1% 1/10W: Resistor Thick Film 0R Jumper 0.1W, 1/10W 0603 (1608 metric) Jumper; MPN: CRCW06030000Z0EA; Manufacturer: Vishay; CDI: 017334; Op_Temperature: -55 C to +155 C; Type: Resistor Thick Film; Value: 0R; Tolerance: Jumper; Package: Tape & Reel; RoHS: SIM; Power (Watts): 1/10W; Case: 0603; Price (10k): 0.00318; Price (und.): 0,10000
U6 = STM32G473VCT: Manufacturer: ST - Microlectronics; Op_Temperature: -40°C ~ 85°C; CDI: 020680; Value: STM32G473VCT; MPN: STM32G473VCT; Case: LQFP-100; Package: Tray; Price (10k): 4.78; Price (und.): 8.87; RoHS: SIM; Type: ARM Microcontrollers - MCU; Supplier 1: Newark; Supplier Part Number 1: 39AH3584

## Sheet perifericos.SchDoc: Periféricos do Controlador
size A4; Author: Matheus Gois Vieira; Address1: UnB; Address2: Faculdade do Gama
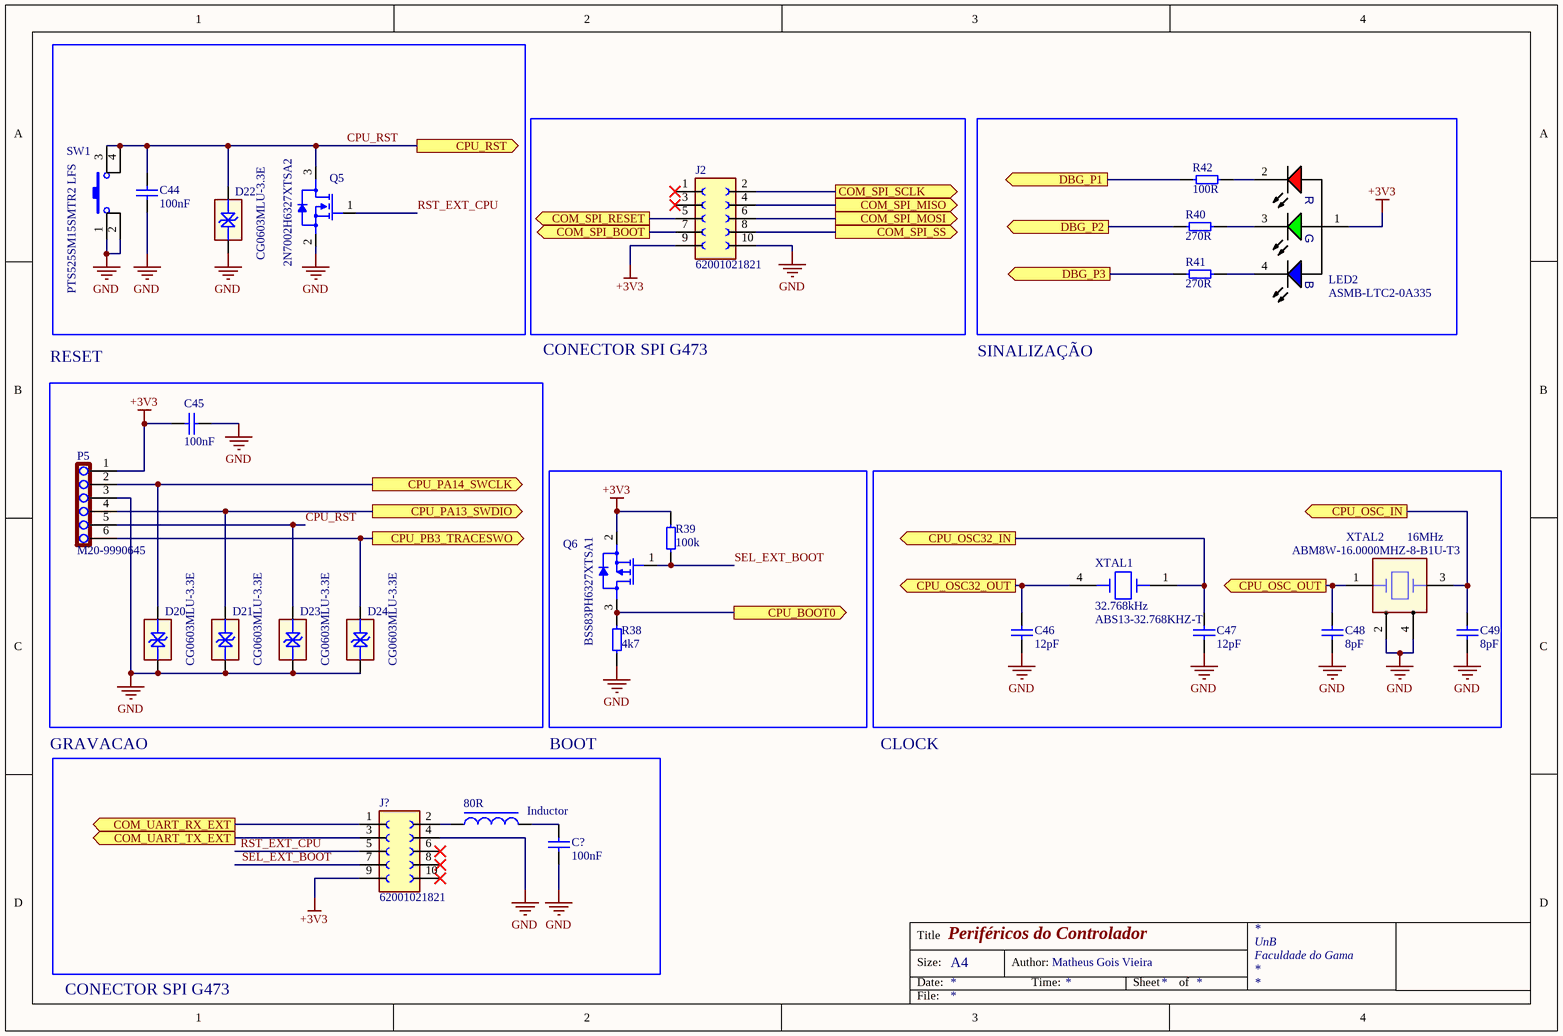
[diagram p4: perifericos.SchDoc]

### Parts
(Parts that share a designator on the sheet are numbered #1, #2 ... from top to bottom, then left to right.)
80R  Inductor  [R1608[0603]]
C44  100nF  [0603]
C45  100nF  [0603]
C46  12pF  [0603]
C47  12pF  [0603]
C48  8pF  [0603]
C49  8pF  [0603]
C?#5  100nF  [0603]
D20  CG0603MLU-3.3E  [DIODE-0603]
D21  CG0603MLU-3.3E  [DIODE-0603]
D22  CG0603MLU-3.3E  [DIODE-0603]
D23  CG0603MLU-3.3E  [DIODE-0603]
D24  CG0603MLU-3.3E  [DIODE-0603]
J2  62001021821  [62001021821]
J?  62001021821  [62001021821]
LED2  ASMB-LTC2-0A335  [ASMB-LTC2-0A335]
P5  M20-9990645  [HDR1X6-2.54MM]
Q5  2N7002H6327XTSA2  [CI-SOT-23]
Q6  BSS83PH6327XTSA1  [CI-SOT-23]
R38  4k7  [0603]
R39  100k  [0603]
R40  270R  [0603]
R41  270R  [0603]
R42  100R  [0603]
SW1  value PTS525SM15SMTR2 LFS  [SWTCH]  (hidden comment: Tact Switch)
XTAL1  32.768kHz  MPN: ABS13-32.768KHZ-T  [XTAL4P_ABS13]
XTAL2  16MHz  MPN: ABM8W-16.0000MHZ-8-B1U-T3  [XTAL4P]

### Blocks framed on the sheet
RESET: C45 D20 D21 D23 D24 P5

### Ports
COM_SPI_BOOT (out), COM_SPI_MISO (out), COM_SPI_MOSI (out), COM_SPI_RESET (out), COM_SPI_SCLK (out), COM_SPI_SS (out), COM_UART_RX_EXT (out), COM_UART_TX_EXT (out), CPU_BOOT0 (out), CPU_OSC32_IN (out), CPU_OSC32_OUT (out), CPU_OSC_IN (out), CPU_OSC_OUT (out), CPU_PA13_SWDIO (out), CPU_PA14_SWCLK (out), CPU_PB3_TRACESWO (out), CPU_RST (out), DBG_P1 (out), DBG_P2 (out), DBG_P3 (out)

### Nets
+3V3: C45.1 J2.9 J?.9 LED2.1(A) P5.1 Q6.2(S) R39.2
GND: C44.2 C45.2 C46.1 C47.1 C48.1 C49.1 C?#5.2 D20.1 D21.1 D22.1 D23.1 D24.1 J2.10 J?.4 P5.3 Q5.2(S) R38.1 SW1.1 SW1.2 XTAL2.2(GND) XTAL2.4(GND)  [project net VSSA]
CPU_RST: C44.1 D22.2 D23.2 P5.5 Q5.3(D) SW1.3 SW1.4 ; port CPU_RST
RST_EXT_CPU: J?.5 Q5.1(G)
SEL_EXT_BOOT: J?.7 Q6.1(G) R39.1
Net80R_1: 80R.1 J?.2
Net80R_2: 80R.2 C?#5.1
NetC46_2: C46.2 XTAL1.4 ; port CPU_OSC32_OUT
NetC47_2: C47.2 XTAL1.1 ; port CPU_OSC32_IN
NetC48_2: C48.2 XTAL2.1 ; port CPU_OSC_OUT
NetC49_2: C49.2 XTAL2.3 ; port CPU_OSC_IN
NetD20_2: D20.2 P5.2 ; port CPU_PA14_SWCLK
NetD21_2: D21.2 P5.4 ; port CPU_PA13_SWDIO
NetD24_2: D24.2 P5.6 ; port CPU_PB3_TRACESWO
NetJ2_2: J2.2 ; port COM_SPI_SCLK
NetJ2_4: J2.4 ; port COM_SPI_MISO
NetJ2_5: J2.5 ; port COM_SPI_RESET
NetJ2_6: J2.6 ; port COM_SPI_MOSI
NetJ2_7: J2.7 ; port COM_SPI_BOOT
NetJ2_8: J2.8 ; port COM_SPI_SS
NetJ?_1: J?.1 ; port COM_UART_RX_EXT
NetJ?_3: J?.3 ; port COM_UART_TX_EXT
NetLED2_2: LED2.2(R) R42.2
NetLED2_3: LED2.3(G) R40.2
NetLED2_4: LED2.4(B) R41.2
NetQ6_3: Q6.3(D) R38.2 ; port CPU_BOOT0
NetR40_1: R40.1 ; port DBG_P2
NetR41_1: R41.1 ; port DBG_P3
NetR42_1: R42.1 ; port DBG_P1

Not connected (* = marked no-connect by the designer): J2 1* 3(2)*; J? 6(8)* 8(7)* 10(6)*

### Notes on the sheet
- CONECTOR SPI G473
- SINALIZAÇÃO
- GRAVACAO
- BOOT
- CLOCK
- Title
- Size:
- Date:
- A4
- Author:
- Time:
- Sheet
- of
- File:

### Library data of the parts
80R = L: Manufacturer: *; PartNumber: *; Package Type: *; Value: *
C44 C45 C?#5 = CAP CER SMD-0603 100nF - 50V: as C?#4 on sheet seccionamento; Type: Capacitor Ceramic; Value: 100nF; Tolerance: 20%; Package: Tape & Reel; RoHS: SIM; Voltage: 50V; Case: 0603 (1608 Metric); Temp_Coefficient: X7R; NCM: *; CDI_Alternate: *; MPN_Alternate: *; Manufacturer_Alternate: *; Price (und.): 0,10000; Price (10k): 0.00741
C46 C47 = CAP CER SMD-0603 12pF - 50V: Capacitor Ceramic 12pF 10% 50V 0603 (1608 Metric) C0G (NP0); MPN: 06035A120KAT2A; Manufacturer: AVX; CDI: 020618; Op_Temperature: -55 C to +125 C; Type: Capacitor Ceramic; Value: 12pF; Voltage: 50V; Tolerance: 10%; Package: Tape & Reel; Case: 0603 (1608 Metric); Temp_Coefficient: C0G (NP0); RoHS: SIM; NCM: *; CDI_Alternate: *; MPN_Alternate: *; Manufacturer_Alternate: *; Price (und.): 0.22; Price (10k): 0.039
C48 C49 = CAP CER SMD-0603 8pF - 50V: Capacitor Ceramic 8pF 50V 0603 (1608 Metric) C0G (NP0); MPN: CC0603DRNPO9BN8R0; Manufacturer: Yageo; CDI: 020657; Tolerance: 0.5pF; Op_Temperature: -55 C to +125 C; Type: Capacitor Ceramic; Value: 8pF; Package: Tape & Reel; RoHS: SIM; Voltage: 50V; Case: 0603 (1608 Metric); Temp_Coefficient: C0G (NP0); NCM: *; CDI_Alternate: *; MPN_Alternate: *; Manufacturer_Alternate: *; Price (und.): 0,10000; Price (10k): 0.01346
D20-D24 = DIODE SMD CG0603MLU-3.3E: TVS DIODE 3.3V 25V 0603 (1608 metric); Manufacturer: Bourns; Type: Diode TVS; Op_Temperature: -40 C to +125 C; CDI: 014983; Value: CG0603MLU-3.3E; Package: Tape & Reel; MPN: CG0603MLU-3.3E; RoHS: SIM; Price (und.): 0,44; Voltage: 3.3V; Case: 0603 (1608 metric); Price (10k): 0.112
J2 J? = 62001021821: Female header Temperature range: -40 ... +125 Â°C Colour: Black Connector Design: Double Row / Straight Connector Termination: THT Contact material: Gold-Plated Copper Gender of contacts: Female Housing Material: Polybutylene Terephthalate (PBT) Pitch: 2 mm Series: WR-PHD Poles: 10 Rated current: 2 A Rated voltage: 250 VAC; MF: WÃ¼rth Elektronik; SnapEDA_Link: https://www.snapeda.com/parts/62001021821/Wurth+Elektronik/view-part/?ref=snap; Availability: In Stock; Package: None; Check_prices: https://www.snapeda.com/parts/62001021821/Wurth+Elektronik/view-part/?ref=eda; Price: None; MP: 62001021821; Purchase-URL: https://pricing.snapeda.com/search/part/62001021821/?ref=eda; Value: *
LED2 = LED2 SMD-2121 PLCC4 RGB AComum: LED SMD-2121 PLCC4 RGB - 70mcd Red (2V), 300mcd Green (2.7V), 50mcd Blue (2.7V); Manufacturer: Broadcom Limited; Type: LED SMD; Millicandela_Rating: 70mcd Red, 300mcd Green, 50mcd Blue; Voltage_Forward_Vf_Typ: Red (2V), Green (2.7V), Blue (2.7V); Wavelength_Dominant: 621nm Red, 525nm Green, 468nm Blue; Current_Test: 5mA; Complement_Value: Angle 105°; PCB_INFO: Assembly; Extra_Info: -40 C to +85 C; Engineering_Change_Status_Code: Pending; Revisao: A; CDI: 020457; Component Type: Standard; Value: ASMB-LTC2-0A335; Color: RGB; Package: PLCC4; Size_Dimension: 2.10mm L x 2.10mm W; MPN: ASMB-LTC2-0A335; Model_File: LED; RoHS: SIM; Case: 4-SMD, J-Lead; Price (10k): 0.16500; Price (und.): 0,58000
P5 = HEADER 1x6 PTH: Header, 6-Pin, 2.54mm, PCB; Manufacturer: HARWIN; Op_Temperature: -40°C ~ 105°C; CDI: 020492; Type: Header; Value: M20-9990645; Package: Bulk; MPN: M20-9990645; RoHS: SIM; Price (10k): 0.11029; Price (und.): 0.29000; Case: PTH 1mm 2X2 2.54MM
Q5 = MOSFET N-CHANNEL 2N7002: MOSFET N-CH 60V 300mA SOT23-3; Manufacturer: Infineon; Op_Temperature: -55°C ~ 150°C; CDI: 020458; Type: MOSFET; Value: 2N7002H6327XTSA2; Current_Id: 300mA; Package: Tape & Reel; MPN: 2N7002H6327XTSA2; RoHS: SIM; Case: SOT-23-3; Current: 300mA; Price (10k): 0.04370; Price (und.): 0,29000
Q6 = MOSFET P-CHANNEL BSS83P: MOSFET P-CH 60V 330mA SOT23-3; Manufacturer: Infineon; Op_Temperature: -55°C ~ 150°C; CDI: 020459; Type: MOSFET; Value: BSS83PH6327XTSA1; Current_Id: 330mA; Package: Tape & Reel; MPN: BSS83PH6327XTSA1; RoHS: SIM; Case: SOT-23-3; Current: 330mA; Price (10k): 0.10362; Price (und.): 0,49000
R38 = RES SMD-0603 4k7 0.5% 1/16W: Resistor Thick Film 4k7 0.5% 0.063W, 1/16W 0603 (1608 metric) +/- 25 PPM / K; MPN: RR0816P-472-D; Manufacturer: Susumu; CDI: 019051; Op_Temperature: -55 C to +125 C; Type: Resistor Thick Film; Value: 4k7; Package: Tape & Reel; RoHS: SIM; Tolerance: 0.5%; Power (Watts): 1/16W; Case: 0603; Price (10k): 0.00993; Price (und.): 0,10000
R39 = RES SMD-0603 100k 1% 1/10W: Resistor Thick Film 100k 1% 0.1W, 1/10W 0603 (1608 metric) +/- 100 PPM / K; MPN: CRCW0603100KFKEA; Manufacturer: Vishay; MPN_Alternate: ERJ-3EKF1003V; CDI: 017438; Op_Temperature: -55 C to +155 C; Type: Resistor Thick Film; Value: 100k; Tolerance: 1%; Package: Tape & Reel; RoHS: SIM; Power (Watts): 1/10W; Case: 0603; Price (10k): 0.00468; Price (und.): 0,10000
R40 R41 = RES SMD-0603 270R 1% 1/10W: Resistor Thick Film 270 Ohms ±1% 0.1W, 1/10W Chip Resistor 0603 (1608 Metric) Automotive AEC-Q200 Thick Film; MPN: RMCF0603FT270R; Manufacturer: Stackpole Electronics Inc; CDI: 013719; Op_Temperature: -55 C to +155 C; Type: Resistor Thick Film; Value: 270R; Tolerance: ±1%; Package: Tape & Reel; RoHS: SIM; Power (Watts): 1/10W; Voltage: *; Case: 0603; NCM: *; CDI_Alternate: *; MPN_Alternate: *; Manufacturer_Alternate: *; Price (und.): 0,10000; Price (10k): 0.00218
R42 = RES SMD-0603 100R 1% 1/10W: Resistor Thick Film 100R 1% 0.1W, 1/10W 0603 (1608 metric) +/- 100 PPM / K; MPN: RC0603FR-07100RL; Manufacturer: Yageo; CDI: 020463; Op_Temperature: -55 C to +155 C; Type: Resistor Thick Film; Value: 100R; Tolerance: 1%; Package: Tape & Reel; RoHS: SIM; Power (Watts): 1/10W; Case: 0603; Price (10k): 0.002; Price (und.): 0.10
SW1 = Tact Switch: Chave pushbuttom NA polo simples SMD; Manufacturer: C&K; CDI: 014225; Op_Temperature: -20°C ~ 70°C; MPN: PTS525SM15SMTR2 LFS; Case: 5.25x5.25mm; Package: Tape & Reel; Price (10k): 0.16066; Price (und.): 0,29000; RoHS: SIM; Type: Switches
XTAL1 = XTAL-ABS13-32.768kHz: Crystal 32.768kHz 20PPM SMD; Manufacturer: Abracon; Clamper_PN: XTAL0010; Op_Temperature: -40°C ~ 85°C; CDI: 020477; Case: 2-SMD; Value: 32.768kHz; Tolerance: 20PPM; Package: Tape & Reel; Price (10k): 0.45; Price (und.): 0.79; RoHS: SIM; Type: Crystals
XTAL2 = XTAL-ABM8W-16MHz: Crystal 16MHz 10PPM SMD; Manufacturer: Abracon; Clamper_PN: XTAL0010; Op_Temperature: -20°C ~ 70°C; CDI: 020479; Case: 4-SMD; Value: 16MHz; Tolerance: 10PPM; Package: Tape & Reel; Price (10k): 0.33408; Price (und.): 0,69000; RoHS: SIM; Type: Crystals

## Nets that join several sheets
+3V3: seccionamento (R?#3.2), controlador (6 pins), perifericos (7 pins)
VSSA: power_supply (7 pins), cond_sinais (21 pins), seccionamento (5 pins), controlador (23 pins), perifericos (21 pins)
CPU_RST: controlador (U6.14), perifericos (7 pins)
NetC18_2: cond_sinais (8 pins), controlador (U6.17)
NetC46_2: controlador (U6.8), perifericos (C46.2 XTAL1.4)
NetC47_2: controlador (U6.9), perifericos (C47.2 XTAL1.1)
NetC48_2: controlador (U6.13), perifericos (C48.2 XTAL2.1)
NetC49_2: controlador (U6.12), perifericos (C49.2 XTAL2.3)
NetC?#4_1: seccionamento (C?#4.1 R?#4.2), controlador (U6.20)
NetD20_2: controlador (U6.77), perifericos (D20.2 P5.2)
NetD21_2: controlador (U6.76), perifericos (D21.2 P5.4)
NetD24_2: controlador (U6.90), perifericos (D24.2 P5.6)
NetQ6_3: controlador (U6.95), perifericos (Q6.3 R38.2)
NetR23_1: seccionamento (R23.1), controlador (U6.15)
NetR24_1: seccionamento (R24.1), controlador (U6.70)
NetR40_1: controlador (U6.91), perifericos (R40.1)
NetR41_1: controlador (U6.47), perifericos (R41.1)
NetR42_1: controlador (U6.92), perifericos (R42.1)